# Altium schematic sheet 07-EEPROM.SchDoc
size A
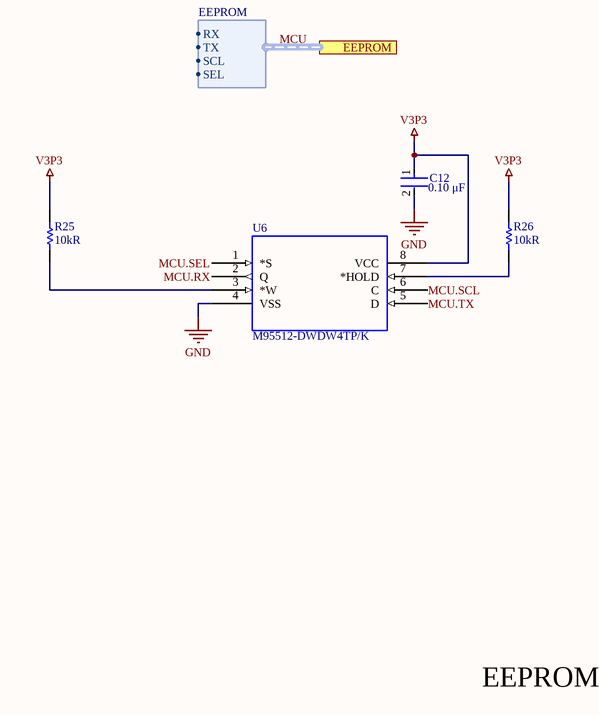
[diagram p0: 07-EEPROM.SchDoc]

## Parts
C12  Capacitance: 0.10 μF  [FP-C0805C-DN-MFG]  (hidden comment: C0805C104K5RACTU)
R25  Resistance: 10kR  [RESC2013X60X35NL10T20]  (hidden comment: RC0805FR-0710KL)
R26  Resistance: 10kR  [RESC2013X60X35NL10T20]  (hidden comment: RC0805FR-0710KL)
U6  M95512-DWDW4TP/K  [TSSOP8_169MILS_DW_STM-M]

## Ports
EEPROM (harness EEPROM)

## Harnesses
EEPROM: RX, TX, SCL, SEL

## Nets
GND: C12.2 U6.4(VSS)
V3P3: C12.1 R25.1 R26.1 U6.8(VCC)
MCU.RX: U6.2(Q)
MCU.SCL: U6.6(C)
MCU.SEL: U6.1(*S)
MCU.TX: U6.5(D)
NetR25_2: R25.2 U6.3(*W)
NetR26_2: R26.2 U6.7(*HOLD)

## Buses and harness runs
harness MCU = port EEPROM

## Notes on the sheet
- EEPROM

## Library data of the parts
C12 = CMP-2007-00279-2: CAP CER 0.1UF 50V X7R 0805; Manufacturer: KEMET; Value: 0.10 μF; Tolerance: 0.1; Temperature Coefficient: 30ppm/°C; Material: Ceramic; Voltage: 500V; Manufacturer Part Number: C0805C104K5RACTU; Device Class L2: Capacitors; Temperature Range Low: -55°C; Voltage Rating: 50 V; Digikey Description: CAP CER 0.1UF 50V X7R 0805; Category: Cap; ComponentLink2Description: Datasheet; Octopart: https://octopart.com/c0805c104k5ractu-kemet-143926; RoHS: TRUE; ComponentLink2URL: https://content.kemet.com/datasheets/KEM_C1003_C0G_SMD.pdf; Temperature Characteristic: X7R; Temperature: -55°C to +125°C; Height: 0.88mm; Temperature Range High: +125°C; Device Class L1: Passive Components; Automotive: No; Lead Free: Yes; Ipc Land Pattern Name: CAPC200125X78; Device Class L3: Ceramic Capacitors; Mouser Description: Cap Ceramic 0.1uF 50V X7R 10% SMD 2.0 x 1.2 mm 125 C Paper T/R; Package: C0805C-DN; Supplier: Digikey; Supplier Part Number: 399-C0805C104K5RAC7800CT-ND; Stock: 2466194; Pricing: 1=0.14, 10=0.091, 50=0.0546, 100=0.043, 500=0.03172, 1000=0.02627 (USD); Mounting Technology: Surface Mount,PCB; Case/Package: 0805; Pins: 2; Case Code (Imperial): 0805; Case Code (Metric): 2012; Min Operating Temperature: -55°C; Max Operating Temperature: 125°C; Dielectric: X7R; Package Quantity: 4000; Packaging: Tape and Reel; Voltage Rating (DC): 50V; Termination: SMD/SMT; Series: SMD Comm X7R; Construction: Flat; Length: 2mm; Width: 1.2mm; Depth: 1.25mm; Lead Pitch: 0.75mm; Radiation Hardening: No; RoHS Compliant: Yes; Reach SVHC Compliant: No; ComponentLink1URL: https://datasheet.ciiva.com/32431/slceramic-chip-condensers-e-32431755.pdf?src-supplier=Distrelec; ComponentLink1Description: https://datasheet.ciiva.com/32431/slceramic-chip-condensers-e-32431755.pdf?src-supplier=Distrelec; ComponentLink3URL: https://datasheet.ciiva.com/28682/1851736-28682232.pdf?src-supplier=Element14; ComponentLink3Description: https://datasheet.ciiva.com/28682/1851736-28682232.pdf?src-supplier=Element14; ComponentLink4URL: https://datasheet.ciiva.com/18410/70095383-18410815.pdf?src-supplier=Allied+Electronics; ComponentLink4Description: https://datasheet.ciiva.com/18410/70095383-18410815.pdf?src-supplier=Allied+Electronics; ComponentLink5URL: https://datasheet.ciiva.com/14589/70095383-14589048.pdf?src-supplier=Allied+Electronics; ComponentLink5Description: https://datasheet.ciiva.com/14589/70095383-14589048.pdf?src-supplier=Allied+Electronics
R25 R26 = CMP-1659-00013-4: Chip Resistor, 10 KOhm, +/- 1%, 0.125 W, -55 to 155 degC, 0805 (2012 Metric), RoHS, Tape and Reel; Manufacturer: Yageo; Voltage Rating: 150 V; Power Rating: 125mW; Temperature Coefficient: 100ppm/°C; Mount: Surface Mount; ComponentLink1Description: Manufacturer URL; ComponentLink2URL: http://www.yageo.com/documents/recent/PYu-RC_Group_51_RoHS_L_04.pdf; Pins: 2; Length: 2 mm; Min Operating Temperature: -55 degC; Height: 0.5 mm; Mounting Technology: Surface Mount; RoHSCompliant: true; REACH SVHC: No SVHC; ComponentLink1URL: http://www.yageo.com/; Max Operating Temperature: 155 degC; PackageReference: 0805; DatasheetVersion: Rev. 4, 02/2016; Package Quantity: 5000; Packaging: Tape and Reel; ComponentLink2Description: Datasheet; PackageDescription: 2-Pin Surface Mounted Device, Body 2 x 1.25 mm; Supplier 1: Digi-Key; Supplier Part Number 1: 311-10.0KCRCT-ND; Manufacturer 1: Yageo; Manufacturer Part Number 1: RC0805FR-0710KL; RoHS: Yes; Category: Chip SMD Resistors; Stock 1: 12202331; Pricing 1: 1=0.10000, 10=0.03700, 100=0.01520, 1000=0.00682, 2500=0.00592 (USD); Case/Package: 0805; Case Code (Imperial): 0805; Case Code (Metric): 2012; Size Code: 0805; Tolerance: 1%; Termination: SMD/SMT; Series: RC; Max Power Dissipation: 125mW; Resistance Tolerance: 1%; Resistor Type: Thick Film; Number of Terminations: 2; Features: Moisture Resistant; Construction: Rectangular; Technology: THICK FILM; Width: 0.049inch; Depth: 1.25mm; RoHS Compliant: Yes; Lead Free: Lead Free; Military Standard: Not
U6 = M95512-DWDW4TP/K: EEPROM Serial-SPI 512K-bit 64K x 8 3.3V/5V Automotive 8-Pin TSSOP T/R; Mfr_Name: STMicroelectronics; Interface: SPI,Serial; Density: 512Kb; Frequency: 10MHz; Min Supply Voltage: 2.5V; Max Supply Voltage: 5.5V; Access Time: 25ns; Max Frequency: 16MHz; Nominal Supply Current: 4mA; ComponentLink1URL: https://datasheet.ciiva.com/29614/dm00046608-29614432.pdf?src-supplier=Digi-Key; ComponentLink1Description: https://datasheet.ciiva.com/29614/dm00046608-29614432.pdf?src-supplier=Digi-Key; ComponentLink2URL: https://datasheet.ciiva.com/48501/dm00046608-48501612.pdf?src-supplier=Avnet; ComponentLink2Description: https://datasheet.ciiva.com/48501/dm00046608-48501612.pdf?src-supplier=Avnet; RoHS: Yes; Category: EEPROM; Case/Package: TSSOP; Min Operating Temperature: -40°C; Max Operating Temperature: 145°C; Packaging: Tape and Reel; Radiation Hardening: No; RoHS Compliant: Yes; Copyright: Copyright (C) 2022 Ultra Librarian. All rights reserved.; Manufacturer_Part_Number: M95512-DWDW4TP/K; RefDes: RefDes; Type: DEV; Supplier 1: Digi-Key; Supplier Part Number 1: 497-14459-1-ND; Manufacturer 1: STMicroelectronics; Manufacturer Part Number 1: M95512-DWDW4TP/K; Stock 1: 11469; Pricing 1: 1=2.30000, 10=2.07100, 25=2.03920, 50=2.03400, 100=1.81740, 250=1.76084 (USD); Mount: Surface Mount; Number of Pins: 8; Memory Type: EEPROM